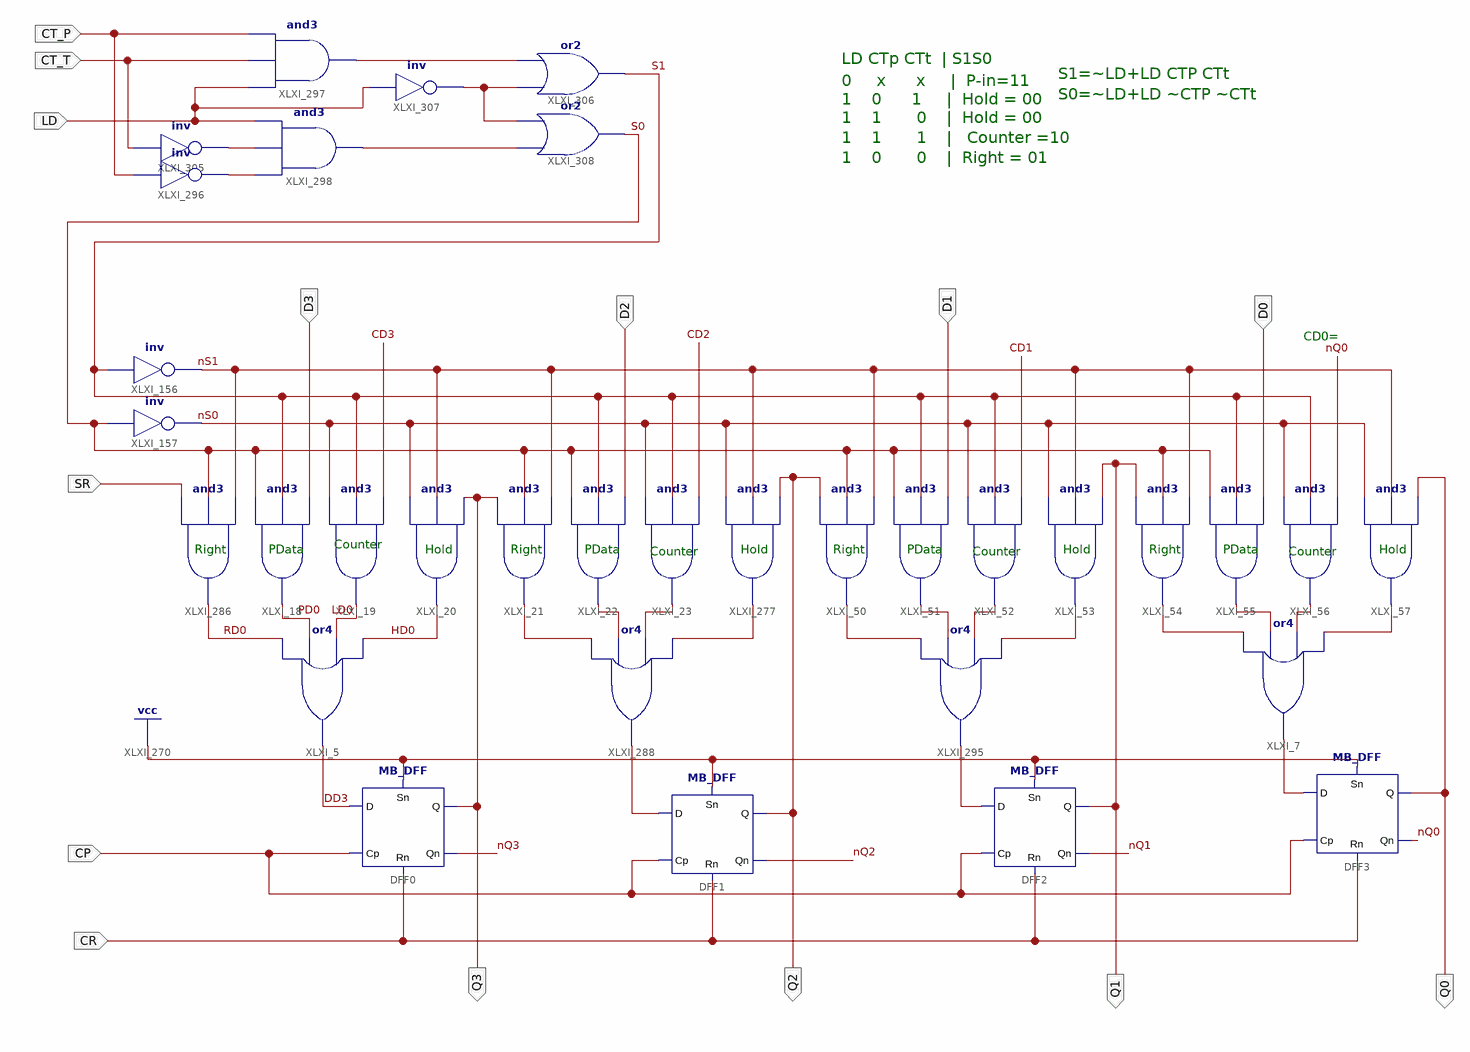
[diagram p0: schematic sheet 1]
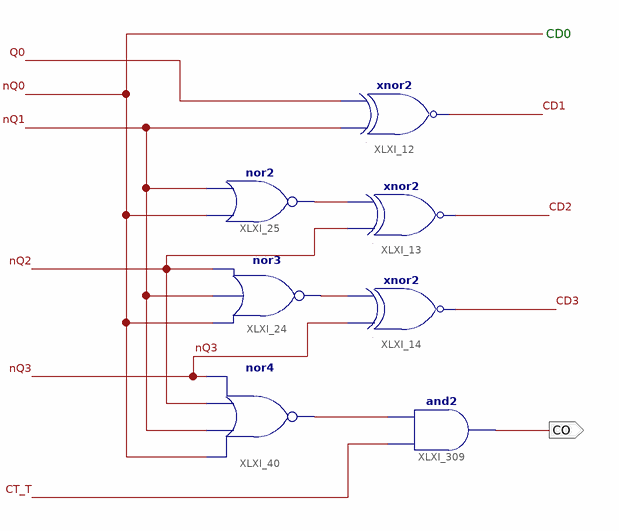
[diagram p1: schematic sheet 2]
// Xilinx ISE schematic CT74LS161.sch (kintex7) as structural Verilog: 40 symbols, 15 ports
module CT74LS161 (
  input  CR,
  input  SR,
  input  D3,
  input  D2,
  input  D1,
  input  D0,
  input  CP,
  input  CT_P,
  input  CT_T,
  input  LD,
  output Q3,
  output Q2,
  output Q1,
  output Q0,
  output CO
);

  wire CD1, CD2, CD3, DD3, HD0, LD0, nQ0, nQ1, nQ2, nQ3, nS0, nS1, PD0, RD0, S0, S1, XLXN_2, XLXN_3, XLXN_4,
       XLXN_43, XLXN_44, XLXN_45, XLXN_46, XLXN_92, XLXN_93, XLXN_94, XLXN_95, XLXN_106, XLXN_107, XLXN_108,
       XLXN_109, XLXN_183, XLXN_186, XLXN_609, XLXN_612, XLXN_616, XLXN_620, XLXN_627, XLXN_628;

  and XLXI_18 (PD0, S0, S1, D3);
  and XLXI_19 (LD0, nS0, S1, CD3);
  and XLXI_20 (HD0, nS0, nS1, Q3);
  and XLXI_21 (XLXN_43, Q3, S0, nS1);
  and XLXI_22 (XLXN_44, S0, S1, D2);
  and XLXI_23 (XLXN_45, nS0, S1, CD2);
  and XLXI_277 (XLXN_46, nS0, nS1, Q2);
  and XLXI_50 (XLXN_92, Q2, S0, nS1);
  and XLXI_51 (XLXN_93, S0, S1, D1);
  and XLXI_52 (XLXN_94, nS0, S1, CD1);
  and XLXI_53 (XLXN_95, nS0, nS1, Q1);
  and XLXI_54 (XLXN_106, Q1, S0, nS1);
  and XLXI_55 (XLXN_107, S0, S1, D0);
  and XLXI_56 (XLXN_108, nS0, S1, nQ0);
  and XLXI_57 (XLXN_109, nS0, nS1, Q0);
  and XLXI_286 (RD0, SR, S0, nS1);
  or XLXI_5 (DD3, RD0, PD0, LD0, HD0);
  or XLXI_288 (XLXN_2, XLXN_43, XLXN_44, XLXN_45, XLXN_46);
  not XLXI_157 (nS0, S0);
  not XLXI_156 (nS1, S1);
  MB_DFF DFF1 (.Cp(CP), .D(XLXN_2), .Qn(nQ2), .Q(Q2), .Sn(1'b1), .Rn(CR));
  MB_DFF DFF2 (.Cp(CP), .D(XLXN_3), .Qn(nQ1), .Q(Q1), .Sn(1'b1), .Rn(CR));
  MB_DFF DFF0 (.Cp(CP), .D(DD3), .Qn(nQ3), .Q(Q3), .Sn(1'b1), .Rn(CR));
  MB_DFF DFF3 (.Cp(CP), .D(XLXN_4), .Qn(nQ0), .Q(Q0), .Sn(1'b1), .Rn(CR));
  or XLXI_295 (XLXN_3, XLXN_92, XLXN_93, XLXN_94, XLXN_95);
  or XLXI_7 (XLXN_4, XLXN_106, XLXN_107, XLXN_108, XLXN_109);
  xnor XLXI_12 (CD1, nQ1, Q0);
  xnor XLXI_13 (CD2, nQ2, XLXN_186);
  nor XLXI_25 (XLXN_186, nQ0, nQ1);
  xnor XLXI_14 (CD3, nQ3, XLXN_183);
  nor XLXI_24 (XLXN_183, nQ0, nQ1, nQ2);
  nor XLXI_40 (XLXN_628, nQ0, nQ1, nQ2, nQ3);
  and XLXI_297 (XLXN_616, LD, CT_T, CT_P);
  and XLXI_298 (XLXN_620, XLXN_612, XLXN_609, LD);
  or XLXI_306 (S1, XLXN_627, XLXN_616);
  not XLXI_307 (XLXN_627, LD);
  or XLXI_308 (S0, XLXN_620, XLXN_627);
  not XLXI_305 (XLXN_609, CT_T);
  not XLXI_296 (XLXN_612, CT_P);
  and XLXI_309 (CO, CT_T, XLXN_628);

  // Notes on the sheet:
  //   LD CTp CTt  | S1S0
  //   S1=~LD+LD CTP CTt
  //   0     x      x     |  P-in=11
  //   S0=~LD+LD ~CTP ~CTt
  //   1    0      1     |  Hold = 00
  //   1    1       0    |  Hold = 00
  //   1    1       1    |   Counter =10
  //   1    0       0    |  Right = 01
  //   CD0=
  //   Counter
  //   Right
  //   PData
  //   Hold
  //   Right
  //   PData
  //   Hold
  //   Right
  //   PData
  //   Hold
  //   Right
  //   PData
  //   Hold
  //   Counter
  //   Counter
  //   Counter
  //   CD0
endmodule
